# Altium schematic sheet Controller.SchDoc: PCB-Tester Controller
size A4; Date: JUN 2020; CheckedBy: Moerz, Hoeren; Author: Rudziński; CompanyName: TDK-Micronas GmbH; DrawnBy: Rudziński; Engineer: Rudziński; Organization: Test Engineering; Address1: Hans-Bunte-Strasse 19; Address2: D-79108 Freiburg; Address3: Germany; DocumentNumber: U33110; Revision: V1.0; SheetNumber: 2; SheetTotal: 20; DateDraw: JUN 2020; DateChecked: 2020-06-19; Workspace: Workspace; TitleTyp: Title-Typ; PageSetup: Record=PageOptions|CenterHorizontal=True|CenterVertical=True|PrintScale=0.97|XCorrection=1.00|YCorrection=1.00|PrintKind=0|BorderSize=5000000|LeftOffset=0|BottomOffset=0|Orientation=2|PaperLength=1000|PaperWidth=1000|Scale=100|PaperSource=7|PrintQuality=-3|MediaType=1|DitherType=10|PrintScaleMode=1|PaperKind=A4|PaperIndex=9
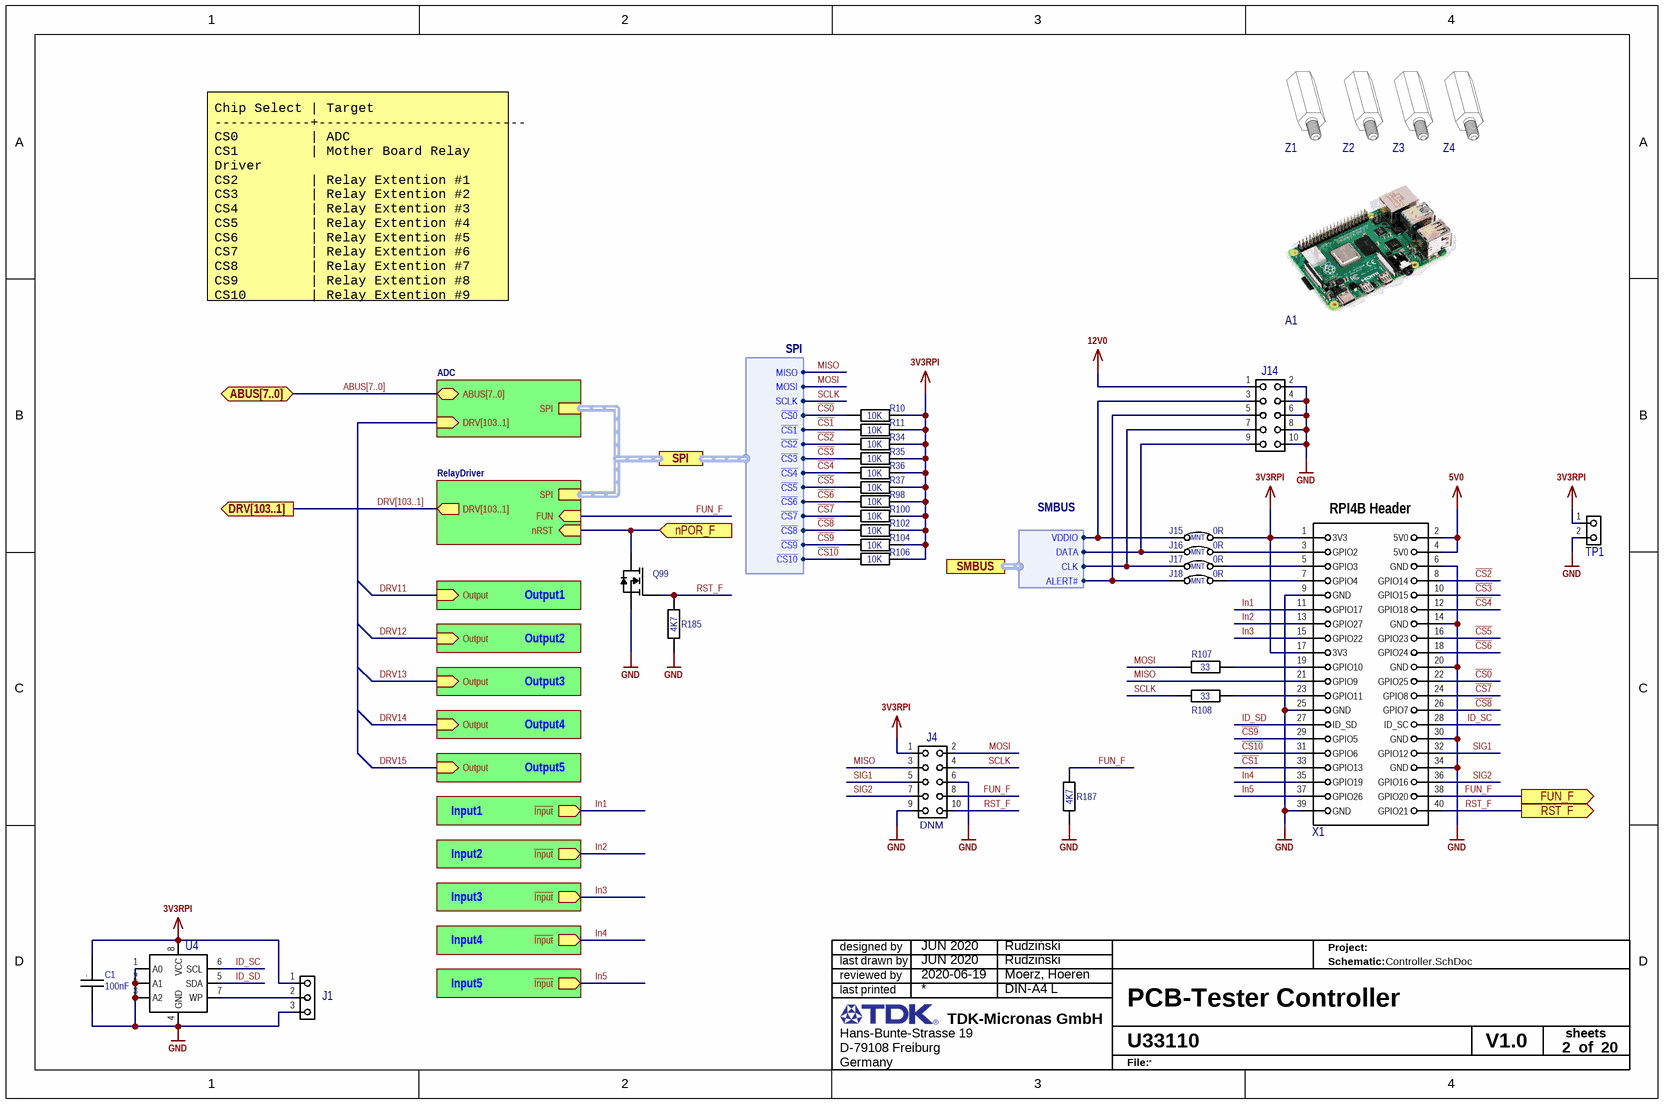
[diagram p0: Controller.SchDoc]

## Parts
A1  A  [RPI4B]  (value not drawn)
C1  value 100nF  [C0402 Reflow]  (hidden comment: C)
J1  J  [Header 100mil 3x1]  (value not drawn)
J4  NicName: DNM  [Header 100mil 5x2]  (hidden comment: J)  (no BOM)
J14  J  [Header 100mil 5x2]  (value not drawn)
J15  value 0R  POPULATED: MNT  [JumperSMD]  (hidden comment: J)  (no BOM)
J16  value 0R  POPULATED: MNT  [JumperSMD]  (hidden comment: J)  (no BOM)
J17  value 0R  POPULATED: MNT  [JumperSMD]  (hidden comment: J)  (no BOM)
J18  value 0R  POPULATED: MNT  [JumperSMD]  (hidden comment: J)  (no BOM)
Q99  Q  [SOT23-3]  (value not drawn)
R10  value 10K  [R0402 Reflow]  (hidden comment: R)
R11  value 10K  [R0402 Reflow]  (hidden comment: R)
R34  value 10K  [R0402 Reflow]  (hidden comment: R)
R35  value 10K  [R0402 Reflow]  (hidden comment: R)
R36  value 10K  [R0402 Reflow]  (hidden comment: R)
R37  value 10K  [R0402 Reflow]  (hidden comment: R)
R98  value 10K  [R0402 Reflow]  (hidden comment: R)
R100  value 10K  [R0402 Reflow]  (hidden comment: R)
R102  value 10K  [R0402 Reflow]  (hidden comment: R)
R104  value 10K  [R0402 Reflow]  (hidden comment: R)
R106  value 10K  [R0402 Reflow]  (hidden comment: R)
R107  value 33  [R0402 Reflow]  (hidden comment: R)
R108  value 33  [R0402 Reflow]  (hidden comment: R)
R185  value 4K7  [R0603 Reflow]  (hidden comment: R)
R187  value 4K7  [R0603 Reflow]  (hidden comment: R)
TP1  TP  [DualTestpoint 100mils]  (value not drawn)  (no BOM)
U4  U  [SOIC8 (R-8)]  (value not drawn)
X1  X  [RPI4B Footprint]  (value not drawn)
Z1  Z  [HSM2.5-6.4-16-2]  (value not drawn)
Z2  Z  [HSM2.5-6.4-16-2]  (value not drawn)
Z3  Z  [HSM2.5-6.4-16-2]  (value not drawn)
Z4  Z  [HSM2.5-6.4-16-2]  (value not drawn)

## Sub-sheets
ADC = ADC.SchDoc: ABUS[7..0] (bidir), SPI (harness SPI), DRV[103..1] (in)
Input = Input.SchDoc: ~{Input} (out)
Input = Input.SchDoc: ~{Input} (out)
Input = Input.SchDoc: ~{Input} (out)
Input = Input.SchDoc: ~{Input} (out)
Input = Input.SchDoc: ~{Input} (out)
Output = Output.SchDoc: Output (in)
Output = Output.SchDoc: Output (in)
Output = Output.SchDoc: Output (in)
Output = Output.SchDoc: Output (in)
Output = Output.SchDoc: Output (in)
RelayDriver = RelayDriver.SchDoc: SPI (harness SPI), DRV[103..1] (out), nRST (in), FUN (in)

## Ports
ABUS[7..0] (bidir), DRV[103..1] (out), FUN_F (out), nPOR_F (in), RST_F (out), SMBUS (harness SMBUS), SPI (harness SPI)

## Harnesses
SPI: MISO, MOSI, SCLK, ~{CS0}, ~{CS1}, ~{CS2}, ~{CS3}, ~{CS4}, ~{CS5}, ~{CS6}, ~{CS7}, ~{CS8}, ~{CS9}, ~{CS10}
SMBUS: ALERT#, CLK, DATA, VDDIO

## Nets
3V3RPI: C1.1 J1.1 J4.1 J15.2 R10.2 R11.2 R34.2 R35.2 R36.2 R37.2 R98.2 R100.2 R102.2 R104.2 R106.2 TP1.1 U4.8(VCC) X1.1(3V3) X1.17(3V3)
5V0: X1.2(5V0) X1.4(5V0)
12V0: J14.1
GND: C1.2 J1.3 J4.6 J4.9 J14.2 J14.4 J14.6 J14.8 J14.10 Q99.2(S) R185.1 R187.1 TP1.2 U4.1(A0) U4.2(A1) U4.3(A2) U4.4(GND) X1.6(GND) X1.9(GND) X1.14(GND) X1.20(GND) X1.25(GND) X1.30(GND) X1.34(GND) X1.39(GND)
~{CS0}: R10.1 X1.22(GPIO25) ; port SPI.~{CS0}
~{CS1}: R11.1 X1.33(GPIO13) ; port SPI.~{CS1}
~{CS2}: R34.1 X1.8(GPIO14) ; port SPI.~{CS2}
~{CS3}: R35.1 X1.10(GPIO15) ; port SPI.~{CS3}
~{CS4}: R36.1 X1.12(GPIO18) ; port SPI.~{CS4}
~{CS5}: R37.1 X1.16(GPIO23) ; port SPI.~{CS5}
~{CS6}: R98.1 X1.18(GPIO24) ; port SPI.~{CS6}
~{CS7}: R100.1 X1.24(GPIO8) ; port SPI.~{CS7}
~{CS8}: R102.1 X1.26(GPIO7) ; port SPI.~{CS8}
~{CS9}: R104.1 X1.29(GPIO5) ; port SPI.~{CS9}
~{CS10}: R106.1 X1.31(GPIO6) ; port SPI.~{CS10}
DRV11: sheet Output/Output
DRV12: sheet Output/Output
DRV13: sheet Output/Output
DRV14: sheet Output/Output
DRV15: sheet Output/Output
FUN_F: J4.8 R187.2 X1.38(GPIO20) ; port FUN_F, sheet RelayDriver/FUN
ID_SC: U4.6(SCL) X1.28(ID_SC)
ID_SD: U4.5(SDA) X1.27(ID_SD)
In1: X1.11(GPIO17) ; sheet Input/~{Input}
In2: X1.13(GPIO27) ; sheet Input/~{Input}
In3: X1.15(GPIO22) ; sheet Input/~{Input}
In4: X1.35(GPIO19) ; sheet Input/~{Input}
In5: X1.37(GPIO26) ; sheet Input/~{Input}
MISO: J4.3 X1.21(GPIO9) ; port SPI.MISO
MOSI: J4.2 R107.1 ; port SPI.MOSI
nPOR_F: Q99.3(D) ; port nPOR_F, sheet RelayDriver/nRST
RST_F: J4.10 Q99.1(G) R185.2 X1.40(GPIO21) ; port RST_F
SCLK: J4.4 R108.1 ; port SPI.SCLK
SIG1: J4.5 X1.32(GPIO12)
SIG2: J4.7 X1.36(GPIO16)
NetJ1_2: J1.2 U4.7(WP)
NetJ14_3: J14.3 J15.1 ; port SMBUS.VDDIO
NetJ14_5: J14.5 J18.1 ; port SMBUS.ALERT#
NetJ14_7: J14.7 J17.1 ; port SMBUS.CLK
NetJ14_9: J14.9 J16.1 ; port SMBUS.DATA
NetJ16_2: J16.2 X1.3(GPIO2)
NetJ17_2: J17.2 X1.5(GPIO3)
NetJ18_2: J18.2 X1.7(GPIO4)
NetR107_2: R107.2 X1.19(GPIO10)
NetR108_2: R108.2 X1.23(GPIO11)

## Buses and harness runs
bus ABUS[7..0] = port ABUS[7..0] = sheet ADC/ABUS[7..0]
bus DRV[103..1] = port DRV[103..1] = sheet ADC/DRV[103..1] = sheet RelayDriver/DRV[103..1]
harness port SPI = sheet ADC/SPI = sheet RelayDriver/SPI

## Notes on the sheet
- Chip Select | Target
  ------------+--------------------------
  CS0         | ADC
  CS1         | Mother Board Relay Driver
  CS2         | Relay Extention #1
  CS3         | Relay Extention #2
  CS4         | Relay Extention #3
  CS5         | Relay Extention #4
  CS6         | Relay Extention #5
  CS7         | Relay Extention #6
  CS8         | Relay Extention #7
  CS9         | Relay Extention #8
  CS10        | Relay Extention #9
- Output1
- Output2
- Output3
- Output4
- Output5
- Input1
- Input2
- Input3
- Input4
- Input5
- designed by
- reviewed by
- last drawn by
- Project:
- Schematic:
- last printed
- DIN-A4 L
- sheets
- of
- File:
- (in symbol C) .
- (in symbol RPI4B Footprint) RPI4B Header

## Library data of the parts
A1 = RPI4B: RASPBERRY PI 4 MODEL B 4GB SDRAM; 07. Manufacturer  Part Number: RASPBERRY PI 4B/4GB; 03. Unit Price: 60.53; 13. Created Date/Name: ??? / Hören; 01. Distributor: DigiKey; 02. Distributor Part Number: 1690-RASPBERRYPI4B/4GB-ND; 04. Manufacturer: Raspberry Pi; ComponentLink1Description: Info; ComponentLink1URL: https://www.digikey.de/products/en/development-boards-kits-programmers/evaluation-boards-embedded-mcu-dsp/786?k=Raspberry&k=&pkeyword=Raspberry&sv=0&pv1742=392511&sf=0&FV=-8%7C786&quantity=&ColumnSort=0&page=1&pageSize=25; ComponentLink2Description: DataSheet; ComponentLink2URL: https://www.raspberrypi.org/documentation/hardware/raspberrypi/bcm2711/rpi_DATA_2711_1p0_preliminary.pdf
C1 = C: CAP CER 0.1UF 25V X7R 0402; 04. Manufacturer: Yageo; 07. Manufacturer  Part Number: CC0402KRX7R8BB104; Tolerance: ±20%; 03. Unit Price: 0.09; 13. Created Date/Name: AUG2018/Hören; ComponentLink1Description: Info; ComponentLink1URL: *; 02. Distributor Part Number: 311-2077-6-ND; 09. Operating Temperature: -xx..+yy°C; 11. RoHS: ???; 01. Distributor: DigiKey; ComponentLink2Description: DataSheet
J1 = Header 3Pins 100mil: CONN HEADER VERT 3POS 2.54MM; 04. Manufacturer: Samtec Inc.; 07. Manufacturer  Part Number: HMTSW-103-07-G-S-240; 03. Unit Price: 0.25; 13. Created Date/Name: AUG2018/Hören; 01. Distributor: Samtec Inc.; 02. Distributor Part Number: HMTSW-103-07-G-S-240; 11. RoHS: YES; ComponentLink1Description: Info; ComponentLink1URL: https://www.samtec.com/products/hmtsw-103-07-g-s-240; ComponentLink2Description: DataSheet; ComponentLink2URL: http://suddendocs.samtec.com/catalog_english/hmtsw.pdf
J4 = Header 5x2Pins 100mil: 04. Manufacturer: Samtec Inc.; 07. Manufacturer  Part Number: HMTSW-103-07-G-S-240; 03. Unit Price: 0.25; 13. Created Date/Name: AUG2018/Hören; 01. Distributor: Samtec Inc.; 02. Distributor Part Number: HMTSW-103-07-G-S-240; 11. RoHS: YES; ComponentLink1Description: Info; ComponentLink1URL: https://www.samtec.com/products/hmtsw-103-07-g-s-240; ComponentLink2Description: DataSheet; ComponentLink2URL: http://suddendocs.samtec.com/catalog_english/hmtsw.pdf
J14 = Header 5x2Pins 100mil: .100" High-Temp Variable Post Height Terminal Strip; 04. Manufacturer: Samtec Inc.; 07. Manufacturer  Part Number: HMTSW-105-07-G-D-240; 03. Unit Price: 0.843; 13. Created Date/Name: AUG2018/Hören; 01. Distributor: Samtec Inc.; 02. Distributor Part Number: HMTSW-105-07-G-D-240; 11. RoHS: YES; ComponentLink1Description: Info; ComponentLink1URL: https://www.samtec.com/products/hmtsw-103-07-g-s-240; ComponentLink2Description: DataSheet; ComponentLink2URL: http://suddendocs.samtec.com/catalog_english/hmtsw.pdf
J15-J18 = Jumper SMD: RES SMD 0 OHM JUMPER 1/10W 0603; 04. Manufacturer: Yageo; 07. Manufacturer  Part Number: RC0603JR-070RL; 03. Unit Price: 0.09; 01. Distributor: DigiKey; 02. Distributor Part Number: 311-0.0GRDKR-ND; 09. Operating Temperature: -55°C ~ 155°C; 11. RoHS: YES; Package: 0603; ComponentLink4Description: Info; ComponentLink4URL: https://www.digikey.de/product-detail/en/yageo/RC0603JR-070RL/311-0.0GRDKR-ND/732569; ComponentLink5Description: DataSheet; ComponentLink5URL: http://www.yageo.com/documents/recent/PYu-RC_Group_51_RoHS_L_10.pdf
Q99 = FDV303N: MOSFET N-CH 25V 680MA SOT-23; 04. Manufacturer: ON Semiconductor; 03. Unit Price: 0.41; 13. Created Date/Name: AUG 2018 / Hören; Rds On: 450 mΩ @ id=500mA & Vgs=4.5V; Vgs,th: 1.5V @ 250uA; Power Rating: 350mW; 3D-Export: No; 01. Distributor: DigiKey; 02. Distributor Part Number: FDV303NDKR-ND; 07. Manufacturer  Part Number: FDV303N; 09. Operating Temperature: -55°C ~ 150°C (TJ); 11. RoHS: YES; ComponentLink1Description: Info; ComponentLink1URL: https://www.digikey.de/product-detail/en/on-semiconductor/FDV303N/FDV303NDKR-ND/1630434; ComponentLink2Description: DataSheet; ComponentLink2URL: https://media.digikey.com/pdf/Data%20Sheets/Fairchild%20PDFs/FDV303N.pdf; Vdss: 25V; Id: 680mA
R10 R11 R34-R37 R98 R100 R102 R104 R106 = R_10: RES SMD 10K OHM 1% 1/16W 0402; 04. Manufacturer: Yageo; 07. Manufacturer  Part Number: RC0402FR-0710KL; 03. Unit Price: 0.09; 13. Created Date/Name: AUG2018/Hören; Power Rating: 63mW; Tolerance: ±1%; ComponentLink1URL: https://www.digikey.de/products/en?keywords=311-10.0KLRDKR-ND; ComponentLink1Description: Info; 02. Distributor Part Number: 311-10.0KLRDKR-ND; 09. Operating Temperature: -55°C ~ 155°C; 11. RoHS: YES; 01. Distributor: DigiKey; ComponentLink2Description: DataSheet; Type: Thick Film; Package: 0402
R107 R108 = R_19: RES SMD 33 OHM 1% 1/16W 0402; 04. Manufacturer: Yageo; 07. Manufacturer  Part Number: RC0402FR-0733RL; 03. Unit Price: 0.09; 13. Created Date/Name: AUG2018/Hören; Power Rating: 63mW; Tolerance: ±1%; ComponentLink1URL: https://www.digikey.de/products/en?keywords=311-33.0LRDKR-ND; ComponentLink1Description: Info; 02. Distributor Part Number: 311-33.0LRDKR-ND; 09. Operating Temperature: -55°C ~ 155°C; 11. RoHS: YES; 01. Distributor: DigiKey; ComponentLink2Description: DataSheet; Type: Thick Film; Package: 0402
R185 R187 = R: RES SMD 4.7K OHM 1% 1/10W 0603; 04. Manufacturer: Yageo; 07. Manufacturer  Part Number: RC0603FR-074K7L; 03. Unit Price: 0.09; 13. Created Date/Name: AUG2018/Hören; Tolerance: ±1%; ComponentLink1URL: *; ComponentLink1Description: Info; 02. Distributor Part Number: 311-4.70KHRCT-ND; 09. Operating Temperature: -xx..+yy°C; 11. RoHS: ???; 01. Distributor: DigiKey; ComponentLink2Description: DataSheet; Package: *
TP1 = DualTestpoint 100mils: Dual testpoint, pitch 2.54mm; 04. Manufacturer: Samtec Inc.; 07. Manufacturer  Part Number: HMTSW-103-07-G-S-240; 03. Unit Price: 0.25; 13. Created Date/Name: AUG2018/Hören; 01. Distributor: Samtec Inc.; 02. Distributor Part Number: HMTSW-103-07-G-S-240; 11. RoHS: YES; ComponentLink1Description: Info; ComponentLink1URL: https://www.samtec.com/products/hmtsw-103-07-g-s-240; ComponentLink2Description: DataSheet; ComponentLink2URL: http://suddendocs.samtec.com/catalog_english/hmtsw.pdf
U4 = 24LC256T-I/SN: IC EEPROM 256K I2C 400KHZ 8SOIC; 04. Manufacturer: Microchip Technology; 03. Unit Price: 0.71; 13. Created Date/Name: AUG 2018 / Hören; 01. Distributor: DigiKey; 02. Distributor Part Number: 24LC256T-I/SNDKR-ND; 07. Manufacturer  Part Number: 24LC256T-I/SN; 11. RoHS: YES; ComponentLink1Description: Info; ComponentLink1URL: https://www.digikey.de/product-detail/en/microchip-technology/24LC256T-I-SN/24LC256T-I-SNDKR-ND/1850685; ComponentLink2Description: DataSheet; ComponentLink2URL: http://ww1.microchip.com/downloads/en/DeviceDoc/24AA256-24LC256-24FC256-Data-Sheet-20001203W.pdf; Package: SOIC8
X1 = RPI4B Footprint: 40 Position Elevated Socket Connector  Through Hole; 04. Manufacturer: Samtec Inc.; 07. Manufacturer  Part Number: ESW-120-23-L-D-LL; 03. Unit Price: 5.34; 13. Created Date/Name: ??? / Hören; 01. Distributor: Samtec; 02. Distributor Part Number: ESW-120-23-L-D-LL; ComponentLink1Description: Info; ComponentLink1URL: https://www.samtec.com/products/esw-120-23-l-d-ll; ComponentLink2Description: DataSheet; ComponentLink2URL: http://suddendocs.samtec.com/catalog_english/esw_th.pdf; System: Connector
Z1-Z4 = HSM2.5-6.4-16-2: HEX STANDOFF M2.5 BRASS 16MM; 04. Manufacturer: Essentra Components; 03. Unit Price: 2.69; 13. Created Date/Name: ??? / Hören; 01. Distributor: DigiKey; 02. Distributor Part Number: HSM2.5-6.4-16-2-ND; 07. Manufacturer  Part Number: HSM2.5-6.4-16-2; ComponentLink1Description: Info; ComponentLink1URL: https://www.digikey.de/products/en/hardware-fasteners-accessories/board-spacers-standoffs/582?k=standoff&k=&pkeyword=standoff&sv=0&pv741=29561&sf=0&FV=29%7C371405%2C1839%7C370197%2C1989%7C0%2C-8%7C582&quantity=&ColumnSort=-1000009&page=1&pageSize=25; ComponentLink2Description: DataSheet; ComponentLink2URL: https://www.essentracomponents.com.sg/images-line/pdfs/HTNSP.pdf